# Altium schematic sheet Connectors.SchDoc
size A4; DocumentNumber: 1; SheetNumber: 1; SheetTotal: 8
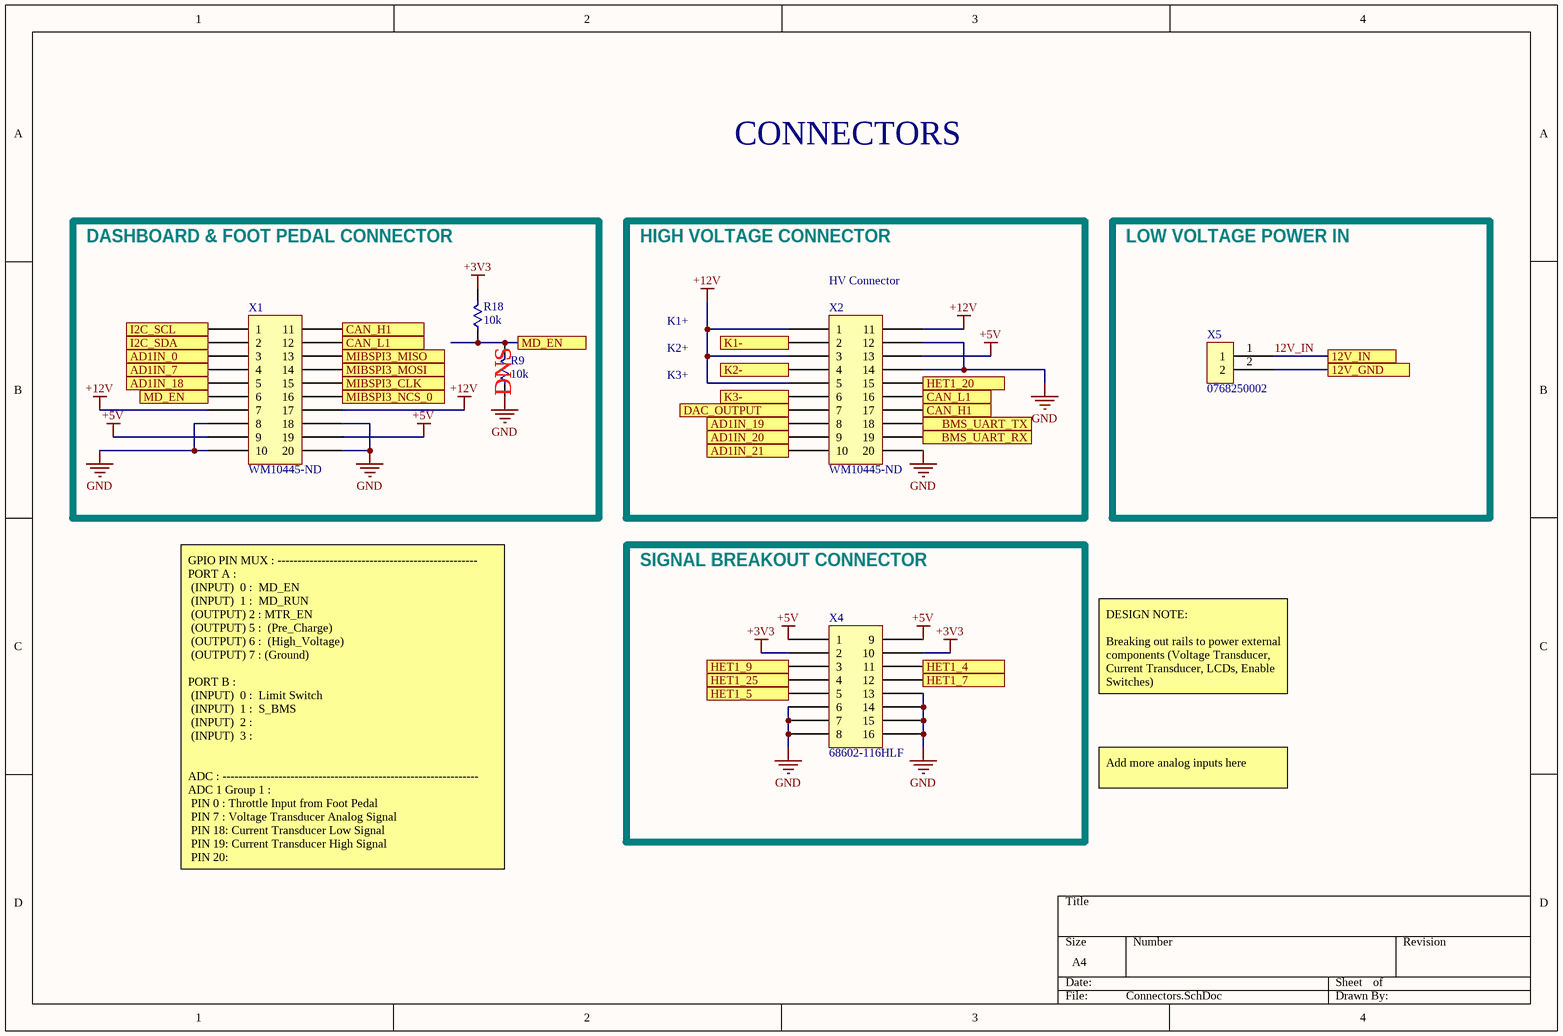
[diagram p0: Connectors.SchDoc]

## Parts
R9  10k  [R0402]
R18  10k  [R0402]
X1  WM10445-ND  [MOLEX_20pin]
X2  WM10445-ND  [MOLEX_20pin]
X4  68602-116HLF  [16PIN_HEADER]
X5  0768250002  [MOLEX_2PIN_MEGAFIT]

## Blocks framed on the sheet
DNS: R9 R18 X1
HIGH VOLTAGE CONNECTOR: X2
LOW VOLTAGE POWER IN: X5
SIGNAL BREAKOUT CONNECTOR: X4

## Ports
12V_GND, 12V_IN, AD1IN_0, AD1IN_7, AD1IN_18, AD1IN_19, AD1IN_20, AD1IN_21, BMS_UART_RX, BMS_UART_TX, CAN_H1, CAN_L1, DAC_OUTPUT, HET1_4, HET1_5, HET1_7, HET1_9, HET1_20, HET1_25, I2C_SCL, I2C_SDA, K1-, K2-, K3-, MD_EN, MIBSPI3_CLK, MIBSPI3_MISO, MIBSPI3_MOSI, MIBSPI3_NCS_0

## Nets
+3V3: R18.2 X4.2 X4.10
+5V: X1.9 X1.19 X2.13 X4.1 X4.9
+12V: X1.7 X1.17 X2.1 X2.3 X2.5 X2.11
GND: R9.1 X1.8 X1.10 X1.18 X1.20 X2.12 X2.14 X2.20 X4.6 X4.7 X4.8 X4.13 X4.14 X4.15 X4.16
12V_GND: X5.2 ; port 12V_GND
12V_IN: X5.1 ; port 12V_IN
AD1IN_0: X1.3 ; port AD1IN_0
AD1IN_7: X1.4 ; port AD1IN_7
AD1IN_18: X1.5 ; port AD1IN_18
AD1IN_19: X2.8 ; port AD1IN_19
AD1IN_20: X2.9 ; port AD1IN_20
AD1IN_21: X2.10 ; port AD1IN_21
BMS_UART_RX: X2.19 ; port BMS_UART_RX
BMS_UART_TX: X2.18 ; port BMS_UART_TX
CAN_H1: X1.11 X2.17 ; port CAN_H1
CAN_L1: X1.12 X2.16 ; port CAN_L1
DAC_OUTPUT: X2.7 ; port DAC_OUTPUT
HET1_4: X4.11 ; port HET1_4
HET1_5: X4.5 ; port HET1_5
HET1_7: X4.12 ; port HET1_7
HET1_9: X4.3 ; port HET1_9
HET1_20: X2.15 ; port HET1_20
HET1_25: X4.4 ; port HET1_25
I2C_SCL: X1.1 ; port I2C_SCL
I2C_SDA: X1.2 ; port I2C_SDA
K1-: X2.2 ; port K1-
K2-: X2.4 ; port K2-
K3-: X2.6 ; port K3-
MD_EN: R9.2 R18.1 X1.6 ; port MD_EN
MIBSPI3_CLK: X1.15 ; port MIBSPI3_CLK
MIBSPI3_MISO: X1.13 ; port MIBSPI3_MISO
MIBSPI3_MOSI: X1.14 ; port MIBSPI3_MOSI
MIBSPI3_NCS_0: X1.16 ; port MIBSPI3_NCS_0

## Notes on the sheet
- CONNECTORS
- DASHBOARD & FOOT PEDAL CONNECTOR
- (near X2) HV Connector
- K1+
- K2+
- K3+
- DESIGN NOTE:
  Breaking out rails to power external components (Voltage Transducer, Current Transducer, LCDs, Enable Switches)
- Add more analog inputs here
- GPIO PIN MUX : --------------------------------------------------
  PORT A :
  (INPUT)		0 : 	MD_EN
  (INPUT)		1 : 	MD_RUN
  (OUTPUT)	2 :	MTR_EN
  (OUTPUT)	5 : 	(Pre_Charge)
  (OUTPUT)	6 : 	(High_Voltage)
  (OUTPUT)	7 :	(Ground)
  PORT B :
  (INPUT)		0 : 	Limit Switch
  (INPUT)		1 : 	S_BMS
  (INPUT)		2 :
  (INPUT)		3 :
  ADC : ----------------------------------------------------------------
  ADC 1 Group 1 :
  PIN 0 : Throttle Input from Foot Pedal
  PIN 7 : Voltage Transducer Analog Signal
  PIN 18: Current Transducer Low Signal
  PIN 19: Current Transducer High Signal
  PIN 20:

## Library data of the parts
R9 R18 = RC0402JR-0710KL: RES SMD 10K OHM 5% 1/16W 0402; Manufacturer: Yageo; Resistance: 10kR; Power Rating: 62.5mW; Voltage Rating: 50V; Temperature Coefficient: 100ppm/°C; Max Power Dissipation: 63mW; Supplier 1: Digi-Key; Manufacturer Part Number: RC0402JR-0710KL; Stock 1: 47303622; Pricing 1: 1=0.1, 10=0.018, 100=0.0073, 1000=0.0033, 2500=0.0029, 5000=0.0024 (USD); Case/Package: 0402; Case Code (Metric): 1005; Case Code (Imperial): 0402; Min Operating Temperature: -55°C; Max Operating Temperature: 155°C; Packaging: Tape and Reel; Tolerance: 5%; Package Quantity: 1; Composition: Thick Film; Number of Terminations: 2; Termination: SMD/SMT; Military Standard: Not; Features: Moisture Resistant; Length: 1mm; Height: 0.016inch; Width: 0.02inch; Depth: 0.5mm; REACH SVHC: Unknown; Lead Free: Lead Free; Supplier Part Number 1: 311-10KJRCT-ND
X1 X2 = 0346916200: CONN_20Positions Molex Stac64 Header, Shrouded Connector 0.100" (2.54mm) Through Hole, Right Angle Tin; Number of Positions: 20; Connector Type: Male Pin; Pitch: 0.1inch; Supplier 1: Digi-Key; Manufacturer: Molex; Manufacturer Part Number: 0346916200; Stock 1: 334; Pricing 1: 1=3.07, 10=2.946, 100=2.4546, 500=2.0864, 1000=1.7796, 5000=1.5955 (USD); Case/Package: 100; Colour: Black; Contact Plating: Tin; Package Quantity: 560; Packaging: Tray; Number of Rows: 2; Termination: Solder; Row Spacing: 0.1inch; ComponentLink1URL: https://datasheet.ciiva.com/29142/987651-0141-29142848.pdf; ComponentLink1Description: https://datasheet.ciiva.com/29142/987651-0141-29142848.pdf; Supplier Part Number 1: WM10445-ND
X4 = 68602-116HLF: CONN_HeaderPins16pos1  6 Positions Header, Unshrouded Connector 0.100" (2.54mm) Through Hole Gold or Gold, GXT™; Manufacturer: Amphenol FCI; Current Rating: 3A; Voltage Rating: 1.5kV; Number of Positions: 16; Gender: Male; Connector Type: Male Pin; Insulation Resistance: 5GR; Row Spacing: 0.1inch; Mating Post Length: 5.84mm; Supplier 1: Digi-Key; Manufacturer Part Number: 68602-116HLF; Stock 1: 1898; Pricing 1: 1=0.79, 10=0.698, 100=0.6019, 500=0.4925, 1000=0.4378, 5000=0.383, 10000=0.3639 (USD); Mount: Through Hole; Contact Plating: Nickel,Gold,GXT; Contact Material: Bronze; Colour: Black; Housing Colour: Black; Housing Material: Thermoplastic; Min Operating Temperature: -65°C; Max Operating Temperature: 125°C; Number of Rows: 2; Packaging: Bulk; Package Quantity: 100; Termination: Solder; Max Voltage Rating (AC): 1.5kV; Number of Contacts: 16; Orientation: Straight; Contact Gender: Male; Length: 20.32mm; Pitch: 2.54mm; Depth: 4.83mm; Contact Mating Length: 0.23inch; Termination Post Length: 3.81mm; Radiation Hardening: No; REACH SVHC: No SVHC; Flammability Rating: UL94 V-0; ComponentLink1URL: https://datasheet.ciiva.com/16726/67996-16726040.pdf; ComponentLink1Description: https://datasheet.ciiva.com/16726/67996-16726040.pdf; ComponentLink2URL: https://datasheet.ciiva.com/9465/67996-9465931.pdf; ComponentLink2Description: https://datasheet.ciiva.com/9465/67996-9465931.pdf; ComponentLink3URL: https://datasheet.ciiva.com/728/67996-728940.pdf; ComponentLink3Description: https://datasheet.ciiva.com/728/67996-728940.pdf; ComponentLink4URL: https://datasheet.ciiva.com/5157/67996-225486-5157197.pdf; ComponentLink4Description: https://datasheet.ciiva.com/5157/67996-225486-5157197.pdf; Supplier Part Number 1: 609-3364-ND
X5 = 0768250002: CONN_2Position_MEGAFIT Molex Through Hole, Right Angle Tin; Number of Positions: 2; Connector Type: Male Pin; Row Spacing: 0.224inch; Supplier 1: Digi-Key; Manufacturer: Molex; Manufacturer Part Number: 0768250002; Stock 1: 2862; Pricing 1: 1=1.08, 10=0.946, 25=0.89, 50=0.853, 100=0.816, 250=0.7418, 500=0.6676, 1000=0.5934, 2500=0.5378 (USD); Mount: Through Hole; Colour: Black; Contact Plating: Tin; Packaging: Tray; Number of Rows: 2; Termination: Solder; Fastening Type: Ramp; ComponentLink1URL: http://www.molex.com/pdm_docs/ps/PS-76823-100.pdf; ComponentLink1Description: http://www.molex.com/pdm_docs/ps/PS-76823-100.pdf; Supplier Part Number 1: WM11969-ND